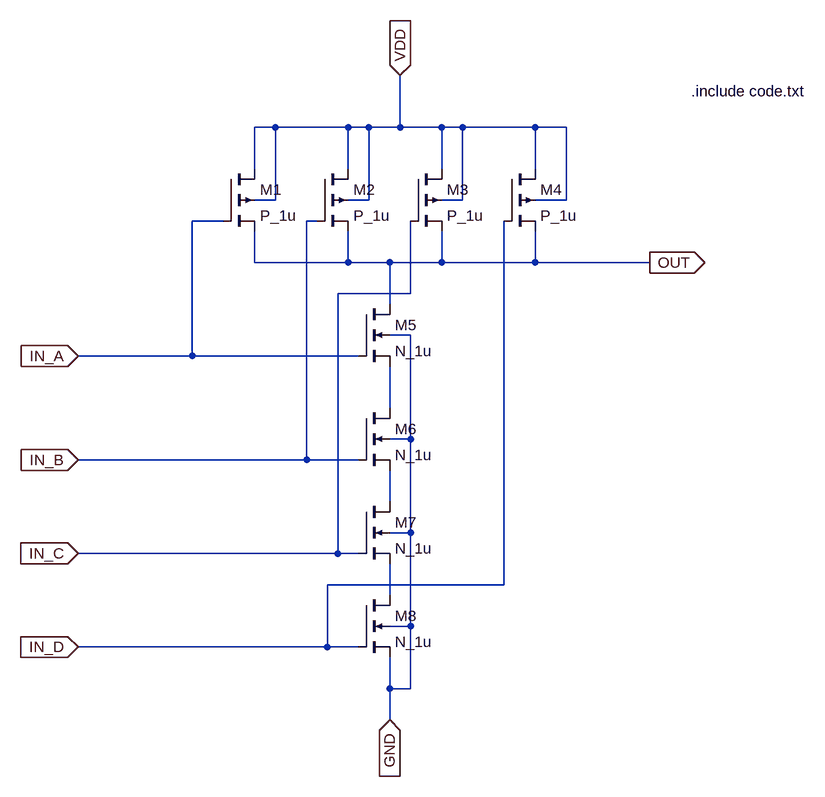
[diagram p0: schematic Circuit2_Part3_4inputNANDUsingMosfets.asc]
Circuit2_Part3_4inputNANDUsingMosfets.asc, the LTspice schematic file:
Version 4
SHEET 1 932 1008
WIRE 96 -16 64 -16
WIRE 208 -16 96 -16
WIRE 240 -16 208 -16
WIRE 288 -16 288 -96
WIRE 288 -16 240 -16
WIRE 352 -16 288 -16
WIRE 384 -16 352 -16
WIRE 496 -16 384 -16
WIRE 544 -16 496 -16
WIRE 64 48 64 -16
WIRE 208 48 208 -16
WIRE 352 48 352 -16
WIRE 496 48 496 -16
WIRE 96 96 96 -16
WIRE 96 96 64 96
WIRE 240 96 240 -16
WIRE 240 96 208 96
WIRE 384 96 384 -16
WIRE 384 96 352 96
WIRE 544 96 544 -16
WIRE 544 96 496 96
WIRE 16 128 -32 128
WIRE 160 128 144 128
WIRE 64 192 64 144
WIRE 208 192 208 144
WIRE 208 192 64 192
WIRE 272 192 208 192
WIRE 352 192 352 144
WIRE 352 192 272 192
WIRE 496 192 496 144
WIRE 496 192 352 192
WIRE 672 192 496 192
WIRE 304 240 304 128
WIRE 304 240 192 240
WIRE 272 256 272 192
WIRE 304 304 272 304
WIRE -32 336 -32 128
WIRE -32 336 -208 336
WIRE 224 336 -32 336
WIRE 272 416 272 352
WIRE 304 464 304 304
WIRE 304 464 272 464
WIRE 144 496 144 128
WIRE 144 496 -208 496
WIRE 224 496 144 496
WIRE 272 560 272 512
WIRE 304 608 304 464
WIRE 304 608 272 608
WIRE 192 640 192 240
WIRE 192 640 -208 640
WIRE 224 640 192 640
WIRE 448 688 448 128
WIRE 448 688 176 688
WIRE 272 704 272 656
WIRE 304 752 304 608
WIRE 304 752 272 752
WIRE 176 784 176 688
WIRE 176 784 -208 784
WIRE 224 784 176 784
WIRE 272 848 272 800
WIRE 304 848 304 752
WIRE 304 848 272 848
WIRE 272 896 272 848
FLAG -208 336 IN_A
IOPIN -208 336 In
FLAG -208 496 IN_B
IOPIN -208 496 In
FLAG -208 640 IN_C
IOPIN -208 640 In
FLAG -208 784 IN_D
IOPIN -208 784 In
FLAG 288 -96 VDD
IOPIN 288 -96 In
FLAG 672 192 OUT
IOPIN 672 192 Out
FLAG 272 896 GND
IOPIN 272 896 In
SYMBOL pmos4 16 48 R0
SYMATTR InstName M1
SYMATTR Value P_1u
SYMATTR Value2 l=1u w=10u
SYMBOL pmos4 160 48 R0
SYMATTR InstName M2
SYMATTR Value P_1u
SYMATTR Value2 l=1u w=10u
SYMBOL pmos4 304 48 R0
SYMATTR InstName M3
SYMATTR Value P_1u
SYMATTR Value2 l=1u w=10u
SYMBOL pmos4 448 48 R0
SYMATTR InstName M4
SYMATTR Value P_1u
SYMATTR Value2 l=1u w=10u
SYMBOL nmos4 224 256 R0
SYMATTR InstName M5
SYMATTR Value N_1u
SYMATTR Value2 l=1u w=10u
SYMBOL nmos4 224 416 R0
SYMATTR InstName M6
SYMATTR Value N_1u
SYMATTR Value2 l=1u w=10u
SYMBOL nmos4 224 560 R0
SYMATTR InstName M7
SYMATTR Value N_1u
SYMATTR Value2 l=1u w=10u
SYMBOL nmos4 224 704 R0
SYMATTR InstName M8
SYMATTR Value N_1u
SYMATTR Value2 l=1u w=10u
TEXT 736 -72 Left 2 !.include code.txt

The netlist it stands for:
* Circuit2_Part3_4inputNANDUsingMosfets.asc
M1 VDD IN_A OUT VDD P_1u l=1u w=10u
M2 VDD IN_B OUT VDD P_1u l=1u w=10u
M3 VDD IN_C OUT VDD P_1u l=1u w=10u
M4 VDD IN_D OUT VDD P_1u l=1u w=10u
M5 OUT IN_A N001 GND N_1u l=1u w=10u
M6 N001 IN_B N002 GND N_1u l=1u w=10u
M7 N002 IN_C N003 GND N_1u l=1u w=10u
M8 N003 IN_D GND GND N_1u l=1u w=10u
.model NMOS NMOS
.model PMOS PMOS
.lib standard.mos
.include code.txt
.backanno
.end